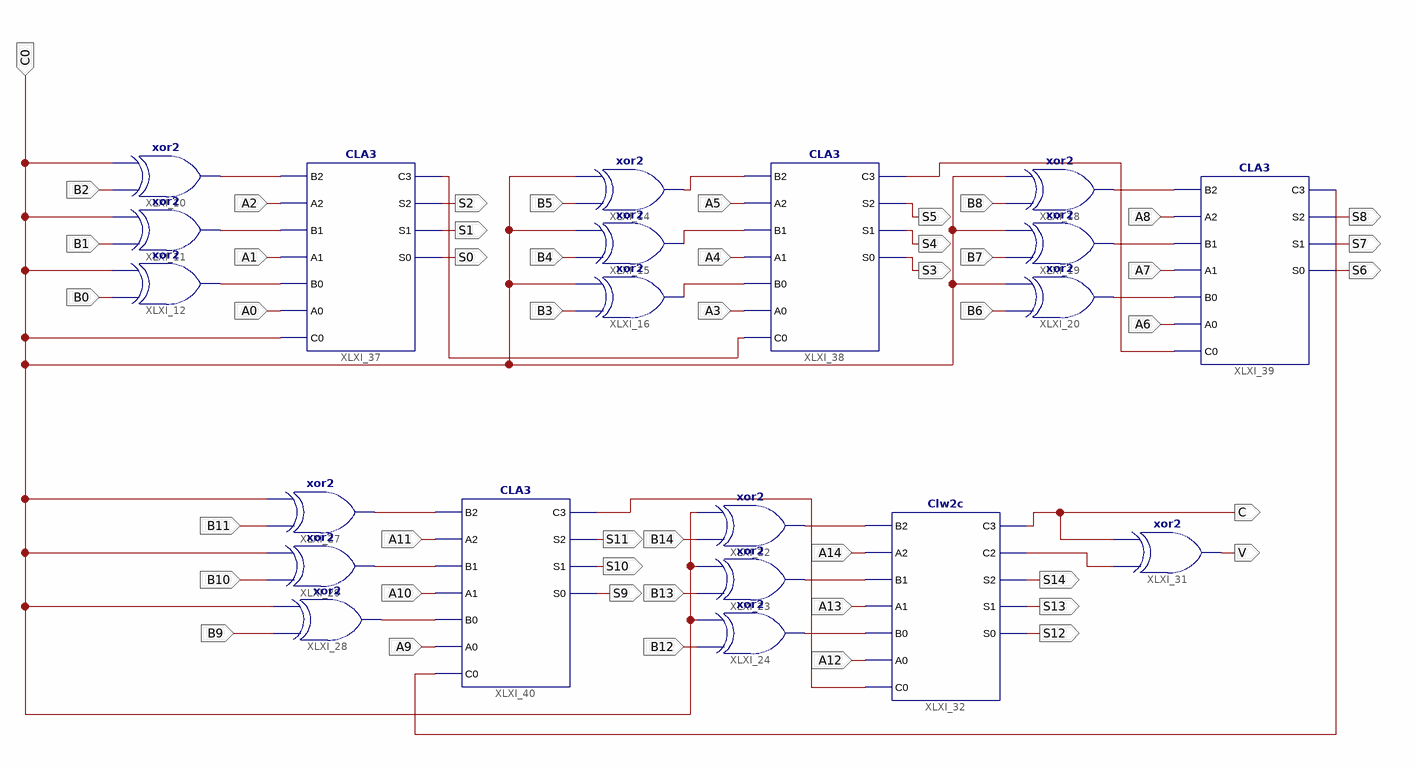
[diagram p0: schematic sheet 1]
// Xilinx ISE schematic CL15.sch (spartan3e) as structural Verilog: 21 symbols, 48 ports
module CL15 (
  input  A2,
  input  A1,
  input  A0,
  input  B2,
  input  B1,
  input  B0,
  input  C0,
  input  A5,
  input  A4,
  input  A3,
  input  B5,
  input  B4,
  input  B3,
  input  A8,
  input  A7,
  input  A6,
  input  B8,
  input  B7,
  input  B6,
  input  A11,
  input  A10,
  input  A9,
  input  A14,
  input  A13,
  input  A12,
  input  B14,
  input  B13,
  input  B12,
  input  B11,
  input  B10,
  input  B9,
  output S0,
  output S1,
  output S2,
  output S3,
  output S4,
  output S5,
  output S6,
  output S7,
  output S8,
  output S9,
  output S10,
  output S11,
  output S12,
  output S13,
  output S14,
  output C,
  output V
);

  wire XLXN_4, XLXN_5, XLXN_6, XLXN_17, XLXN_18, XLXN_19, XLXN_26, XLXN_30, XLXN_31, XLXN_32, XLXN_43,
       XLXN_53, XLXN_54, XLXN_55, XLXN_62, XLXN_75, XLXN_77, XLXN_80, XLXN_88, XLXN_99;

  xor XLXI_10 (XLXN_4, B2, C0);
  xor XLXI_11 (XLXN_5, B1, C0);
  xor XLXI_12 (XLXN_6, B0, C0);
  xor XLXI_14 (XLXN_17, B5, C0);
  xor XLXI_15 (XLXN_18, B4, C0);
  xor XLXI_16 (XLXN_19, B3, C0);
  xor XLXI_18 (XLXN_30, B8, C0);
  xor XLXI_19 (XLXN_31, B7, C0);
  xor XLXI_20 (XLXN_32, B6, C0);
  xor XLXI_22 (XLXN_53, B14, C0);
  xor XLXI_23 (XLXN_54, B13, C0);
  xor XLXI_24 (XLXN_55, B12, C0);
  xor XLXI_27 (XLXN_75, B11, C0);
  xor XLXI_28 (XLXN_80, B9, C0);
  xor XLXI_29 (XLXN_77, B10, C0);
  xor XLXI_31 (V, XLXN_99, C);
  Clw2c XLXI_32 (
    .A0(A12), .A1(A13), .A2(A14), .B0(XLXN_55), .B1(XLXN_54), .B2(XLXN_53), .C0(XLXN_62), .C2(XLXN_99),
    .C3(C), .S0(S12), .S1(S13), .S2(S14));
  CLA3 XLXI_37 (
    .A0(A0), .A1(A1), .A2(A2), .B0(XLXN_6), .B1(XLXN_5), .B2(XLXN_4), .C0(C0), .C3(XLXN_26), .S0(S0),
    .S1(S1), .S2(S2));
  CLA3 XLXI_38 (
    .A0(A3), .A1(A4), .A2(A5), .B0(XLXN_19), .B1(XLXN_18), .B2(XLXN_17), .C0(XLXN_26), .C3(XLXN_43), .S0(S3),
    .S1(S4), .S2(S5));
  CLA3 XLXI_39 (
    .A0(A6), .A1(A7), .A2(A8), .B0(XLXN_32), .B1(XLXN_31), .B2(XLXN_30), .C0(XLXN_43), .C3(XLXN_88), .S0(S6),
    .S1(S7), .S2(S8));
  CLA3 XLXI_40 (
    .A0(A9), .A1(A10), .A2(A11), .B0(XLXN_80), .B1(XLXN_77), .B2(XLXN_75), .C0(XLXN_88), .C3(XLXN_62),
    .S0(S9), .S1(S10), .S2(S11));
endmodule
